# Altium schematic sheet Analogue.SchDoc
size Letter
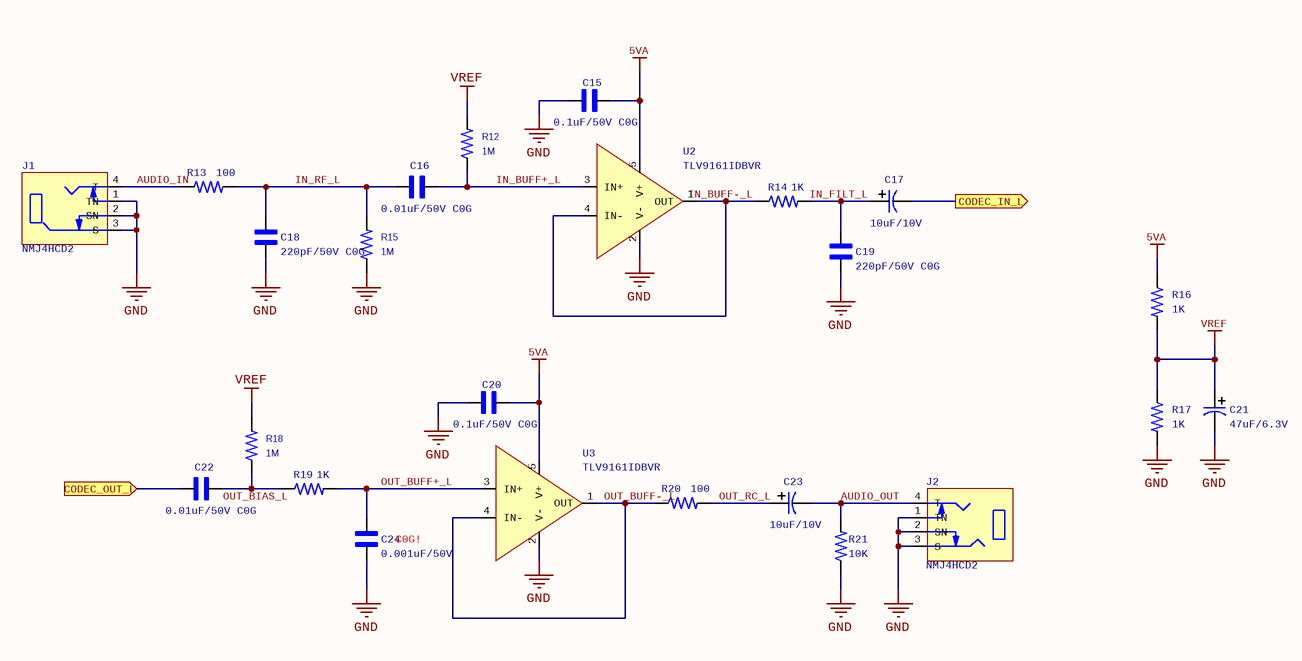
[diagram p0: Analogue.SchDoc]

## Parts
C15  0.1uF/50V C0G  [C0603]
C16  0.01uF/50V C0G  [C0603]
C17  10uF/10V  [EIA1206]
C18  220pF/50V C0G  [C0603]
C19  220pF/50V C0G  [C0603]
C20  0.1uF/50V C0G  [C0603]
C21  47uF/6.3V  [EIA1206]
C22  0.01uF/50V C0G  [C0603]
C23  10uF/10V  [EIA1206]
C24  0.001uF/50V  [C0603]
J1  NMJ4HCD2  [NMJ4HCD2]
J2  NMJ4HCD2  [NMJ4HCD2]
R12  1M  [R0603]
R13  100  [R0603]
R14  1K  [R0603]
R15  1M  [R0603]
R16  1K  [R0603]
R17  1K  [R0603]
R18  1M  [R0603]
R19  1K  [R0603]
R20  100  [R0603]
R21  10K  [R0603]
U2  TLV9161IDBVR  [SOT23-5]
U3  TLV9161IDBVR  [SOT23-5]

## Ports
CODEC_IN_L (out), CODEC_OUT_L (in)

## Nets
5VA: C15.1 C20.1 R16.1 U2.5(V+) U3.5(V+)
GND: C15.2 C18.2 C19.2 C20.2 C21.2 C24.1 J1.1(TN) J1.2(SN) J1.3(S) J2.1(TN) J2.2(SN) J2.3(S) R15.1 R17.2 R21.1 U2.2(V-) U3.2(V-)
VREF: C21.1 R12.2 R16.2 R17.1 R18.2
AUDIO_IN: J1.4(T) R13.1
AUDIO_OUT: C23.2 J2.4(T) R21.2
CODEC_IN_L: C17.2 ; port CODEC_IN_L
CODEC_OUT_L: C22.1 ; port CODEC_OUT_L
IN_BUFF+_L: C16.2 R12.1 U2.3(IN+)
IN_BUFF-_L: R14.1 U2.1(OUT) U2.4(IN-)
IN_FILT_L: C17.1 C19.1 R14.2
IN_RF_L: C16.1 C18.1 R13.2 R15.2
OUT_BIAS_L: C22.2 R18.1 R19.1
OUT_BUFF+_L: C24.2 R19.2 U3.3(IN+)
OUT_BUFF-_L: R20.1 U3.1(OUT) U3.4(IN-)
OUT_RC_L: C23.1 R20.2

## Notes on the sheet
- (near C24) C0G!

## Library data of the parts
C15 C20 = C0603 0.1uF/50V: MLCC 0.1uF 50V C0G 10% 0603; Manufacturer: TDK; Manufacturer Part Number: C1608X5R1H104K080AA; Dielectric Material: Ceramic; Capacitance: 100nF; Dielectric: X5R; Supplier 1: Mouser; Supplier Part Number 1: 810-C1608X5R1H104K; RoHS: Yes; Category: Ceramic Capacitors; Stock 1: 520600; Pricing 1: 1=0.12000, 10=0.04500, 100=0.03700, 500=0.02600, 1000=0.02100, 4000=0.01800 (USD); Mount: Surface Mount; Case/Package: 0603; Number of Pins: 2; Case Code (Metric): 1608; Case Code (Imperial): 0603; Weight: 7.1E-05oz; Min Operating Temperature: -55°C; Max Operating Temperature: 85°C; Tolerance: 10%; Voltage Rating: 50V; Packaging: Tape and Reel; Voltage Rating (DC): 50V; Termination: SMD/SMT; Package Quantity: 1; Resistor Type: Ceramic; Length: 1.6mm; Width: 0.031inch; Height: 0.8mm; Depth: 0.8mm; Thickness: 0.035inch; Radiation Hardening: No; REACH SVHC: No SVHC; Lead Free: Lead Free; Supplier 2: Mouser; Supplier Part Number 2: 187-CL10B104KB8NNNC
C16 C22 = C0603 0.01uF/50V C0G: MLCC 0.01uF 50V C0G 5% 0603; Manufacturer: Murata; Manufacturer Part Number: GRM1885C1H103JA01J; Capacitance: 10nF; Material: 4241ConductorMaterial; Temperature Coefficient: 30ppm/°C; Supplier 1: Mouser; Supplier Part Number 1: 81-GRM1885C1H103JA1J; RoHS: Yes; Category: Ceramic Capacitors; Stock 1: 193832; Pricing 1: 1=0.13, 10=0.052, 50=0.052, 100=0.03, 1000=0.025, 10000=0.018 (USD); Mount: Surface Mount; Case/Package: 0603; Case Code (Metric): 1608; Case Code (Imperial): 0603; Min Operating Temperature: -55°C; Max Operating Temperature: 125°C; Package Quantity: 10000; Packaging: Tape and Reel; Tolerance: 5%; Voltage Rating: 50V; Dielectric: C0G; Termination: SMD/SMT; Voltage Rating (DC): 50V; Series: GRM; Length: 1.6mm; Width: 0.8mm; Height: 0.8mm; RoHS Compliant: Yes; Weight: 0.000222oz
C17 C23 = TANT 10UF/10V: Tantalum Capacitors - Solid SMD 10V 10uF 10%; Manufacturer: KEMET; Manufacturer Part Number: T491A106K010AT; ESR (Equivalent Series Resistance): 4R; Life (Hours): 2000Hour; Polarity: Polar; Dissipation Factor: 6%; Leakage Current: 1uA; Ripple Current: 137mA; Supplier 1: Mouser; RoHS: Yes; Category: Tantalum Capacitors; Stock 1: 88800; Supplier Part Number 1: 80-T491A106K010; Mount: Surface Mount,PCB; Case/Package: 1206; Case Code (Metric): 3216; Case Code (Imperial): 1206; Dielectric Material: Tantalum; Min Operating Temperature: -55°C; Max Operating Temperature: 125°C; Capacitance: 10uF; Tolerance: 10%; Packaging: Tape and Reel; Voltage Rating: 10V; Features: General Purpose; Package Quantity: 2000; Termination: SMD/SMT; Voltage Rating (DC): 10V; Voltage: 10V; Length: 3.2mm; Width: 0.063inch; Height: 1.6mm; Depth: 1.6mm; Height - Seated (Max): 0.071inch; Lead Free: Lead Free; REACH SVHC: No SVHC; Supplier 2: LCSC; Supplier Part Number 2: C110052
C18 C19 = C0603 220pF/50V C0G: MLCC 220pF 50V C0G 5% 0603; Manufacturer: KEMET; Manufacturer Part Number: C0603C221J5GACTU; Dielectric Material: Ceramic; Material: 4241ConductorMaterial; Dissipation Factor: 0.1%; Temperature Coefficient: 30ppm/°C; Supplier 1: Mouser; Supplier Part Number 1: 80-C0603C221J5G; RoHS: Yes; Category: Ceramic Capacitors; Stock 1: 174318; Pricing 1: 1=0.1, 10=0.027, 50=0.027, 100=0.016, 1000=0.011, 10000=0.007 (USD); Mount: Surface Mount; Case/Package: 0603; Min Operating Temperature: -55°C; Max Operating Temperature: 125°C; Packaging: Tape and Reel; Tolerance: 5%; Capacitance: 220pF; Dielectric: C0G; Termination: SMD/SMT; Voltage Rating (DC): 50V; Voltage: 50V; Length: 1.6mm; Height: 0.8mm; Depth: 0.8mm; Radiation Hardening: No; Number of Pins: 2; Case Code (Imperial): 0603; Case Code (Metric): 1608; Package Quantity: 1; Voltage Rating: 50V; Series: C; Construction: Flat; Voltage Rating (AC): 50V; Width: 0.8mm; Thickness: 0.034inch; Lead Pitch: 0.7mm; Lead Free: Lead Free; Reach SVHC Compliant: No; RoHS Compliant: Yes
C21 = TANT 47UF/6.3V: Tantalum Capacitors - Solid SMD 6.3V 47uF 10%; Manufacturer: Kyocera AVX; Manufacturer Part Number: TAJA476K006SNJV; Supplier 1: Mouser; Supplier Part Number 1: 581-TAJA476K006SNJV; RoHS: Yes; Category: Tantalum Capacitors; Stock 1: 97469; Pricing 1: 1=0,57000, 10=0,39900, 50=0,39900, 100=0,20200, 1000=0,15200, 10000=0,12500 (USD); Case/Package: Radial; Voltage Rating (DC): 6.3V; Capacitance: 47uF; Tolerance: 10%; Lead Free: Lead Free; RoHS Compliant: Yes
C24 = C0603 0.001uF/50V: MLCC 0.001uF 50V X5R 10% 0603; Manufacturer: Samsung; Manufacturer Part Number: CL10B102KB8NNNL; Capacitance: 1nF; Dielectric: X7R; Supplier 1: Mouser; Supplier Part Number 1: 187-CL10B102KB8NNNL; RoHS: Yes; Category: Ceramic Capacitors; Stock 1: 55616; Pricing 1: 1=0.10000, 10=0.03500, 50=0.03500, 100=0.01600, 1000=0.00900, 10000=0.00600 (USD); Mount: Surface Mount; Case/Package: 0603; Min Operating Temperature: -55°C; Max Operating Temperature: 125°C; Package Quantity: 15000; Packaging: Tape and Reel; Tolerance: 10%; Voltage Rating: 50V; Voltage Rating (DC): 50V; Series: CL; Construction: Flat; Length: 1.6mm; Width: 0.031inch; Height: 0.8mm; Thickness: 0.035inch; Depth: 0.8mm; Radiation Hardening: No; Lead Free: Lead Free; RoHS Compliant: Yes
J1 J2 = TS Audio Jack 6.3mm: Phone Connectors 2C MONO 2-SPST NC; Manufacturer: Neutrik; Number of Terminals/Pins: 4; Max Current Rating: 3A; Gender: Female; Voltage Rating: 50V; Number of Ports: 1; Number of Contacts: 2; Supplier 1: Mouser; Supplier Part Number 1: 550-12202; Manufacturer Part Number: NMJ4HCD2; RoHS: Yes; Category: Audio / Video Connectors; Stock 1: 39770; Pricing 1: 1=1,51000, 10=1,39000, 50=1,36000, 100=1,18000, 1000=1,11000, 10000=1,10000 (USD); Mount: Through Hole; Number of Pins: 4; Contact Plating: Silver; Color: Black; Contact Material: Brass; Weight: 0.246918oz; Housing Material: Polyamide; Min Operating Temperature: -25°C; Max Operating Temperature: 70°C; Package Quantity: 200; Termination: Through Hole; Orientation: Horizontal; Series: M; RoHS Compliant: Yes; ComponentLink1URL: https://datasheet.ciiva.com/16148/210-199761-16148179.pdf?src-supplier=Onlinecomponents.com; ComponentLink1Description: https://datasheet.ciiva.com/16148/210-199761-16148179.pdf?src-supplier=Onlinecomponents.com
R12 R15 R18 = R0603 1M: RES SMD 1M OHM 1% 1/10W 0603; Manufacturer: Yageo; Manufacturer Part Number: RC0603FR-071ML; Voltage Rating: 75V; Voltage Rating (DC): 50V; Resistance: 1MR; Power Rating: 100mW; Temperature Coefficient: 100ppm/°C; Application(s): HIGH RELIABILITY; Supplier 1: Mouser; Supplier Part Number 1: 603-RC0603FR-071ML; RoHS: Yes; Category: Chip SMD Resistors; Stock 1: 1321822; Pricing 1: 1=0.10000, 10=0.01800, 50=0.01800, 100=0.00700, 1000=0.00400, 10000=0.00200 (USD); Case/Package: 0603; Number of Pins: 2; Case Code (Imperial): 0603; Case Code (Metric): 1608; Weight: 0.000847oz; Min Operating Temperature: -55°C; Max Operating Temperature: 155°C; Tolerance: 1%; Packaging: Cut Tape; Package Quantity: 5000; Termination: SMD/SMT; Resistor Type: Thick Film; Type: General Purpose; Series: RC; Technology: THICK FILM; Length: 1.6mm; Width: 0.8mm; Height: 0.45mm; Depth: 0.8mm; RoHS Compliant: Yes; REACH SVHC: No SVHC; Military Standard: Not; Lead Free: Lead Free
R13 R20 = R0603 100: RES 0603 100 OHM 1% 1/10W; Manufacturer: Yageo; Manufacturer Part Number: RC0603FR-07100RL; Resistance: 100R; Temperature Coefficient: 100ppm/°C; Power Rating: 100mW; Voltage Rating: 50V; Supplier 1: Mouser; Supplier Part Number 1: 603-RC0603FR-07100RL; RoHS: Yes; Category: Chip SMD Resistors; Stock 1: 62434; Pricing 1: 1=0.10000, 10=0.02200, 50=0.02200, 100=0.00800, 1000=0.00600, 10000=0.00400 (USD); Case/Package: 0603; Case Code (Imperial): 0603; Case Code (Metric): 1608; Min Operating Temperature: -55°C; Max Operating Temperature: 155°C; Tolerance: 1%; Resistor Type: Thick Film; Packaging: Tape and Reel; Termination: SMD/SMT; Number of Terminations: 2; Length: 1.6mm; Height: 0.022inch; Width: 0.031inch; Depth: 0.8mm; Lead Free: Lead Free; Military Standard: Not; Contact Plating: Tin,Matte; Weight: 7.1E-05oz; Size Code: 0603; Max Power Dissipation: 100mW; Features: Moisture Resistant,Automotive AEC-Q200; Series: AC; Construction: Rectangular; Radiation Hardening: No; RoHS Compliant: Yes
R14 R16 R17 R19 = R0603 1K: Res Thick Film 0603 1K Ohm 1% 1/10W ±50ppm/°C Molded SMD Paper T/R; Manufacturer: Yageo; Manufacturer Part Number: RE0603FRE071KL; Resistance: 1kR; Max Power Dissipation: 100mW; Supplier 1: Mouser; Supplier Part Number 1: 603-RE0603FRE071KL; RoHS: Yes; Category: Chip SMD Resistors; Stock 1: 21464; Pricing 1: 1=0.11000, 10=0.03800, 50=0.03800, 100=0.01700, 1000=0.00800, 10000=0.00500 (USD); Case/Package: 0603; Min Operating Temperature: -55°C; Max Operating Temperature: 155°C; Packaging: Tape and Reel; Resistor Type: Thick Film; Number of Terminations: 2; Tolerance: 1%; Temperature Coefficient: 50ppm/°C; Features: Moisture Resistant; Length: 0.063inch; Width: 0.032inch; Height: 0.022inch; RoHS Compliant: Yes; ComponentLink1URL: http://www.yageo.com/NewPortal/yageodocoutput?fileName=/pdf/R-Chip/PYu-RE_105_RoHS_L_4.pdf&src-supplier=Digi-Key; ComponentLink1Description: http://www.yageo.com/NewPortal/yageodocoutput?fileName=/pdf/R-Chip/PYu-RE_105_RoHS_L_4.pdf&src-supplier=Digi-Key
R21 = R0603 10K: RES 0603 10K OHM 1% 1/10W; Manufacturer: Yageo; Manufacturer Part Number: RC0603FR-0710KP; Resistance: 10kR; Max Power Dissipation: 100mW; Temperature Coefficient: 150ppm/°C; Supplier 1: Mouser; Supplier Part Number 1: 603-RC0603FR-0710KP; RoHS: Yes; Category: Chip SMD Resistors; Stock 1: 6316; Pricing 1: 1=0.18000, 10=0.04200, 50=0.04200, 100=0.01400, 1000=0.01000, 10000=0.00600 (USD); Case/Package: 0603; Case Code (Metric): 1608; Case Code (Imperial): 0603; Min Operating Temperature: -55°C; Max Operating Temperature: 155°C; Packaging: Tape and Reel; Tolerance: 1%; Resistor Type: Thick Film; Number of Terminations: 2; Features: Moisture Resistant; Length: 0.063inch; Width: 0.031inch; Height: 0.022inch; RoHS Compliant: Yes
U2 U3 = TLV9161IDBVR: Single 10-MHz, 16-V rail-to-rail input/output, very low noise, high slew rate op amp 5-SOT-23 -40 to 125; Manufacturer: Texas Instruments; Supplier 1: Mouser; Manufacturer Part Number: TLV9161IDBVR; RoHS: No; Category: Amplifiers - Op Amps, Buffer, Instrumentation; Stock 1: 20844; Pricing 1: 1=0.94, 10=0.839, 50=0.839, 100=0.654, 1000=0.435, 10000=0.375 (USD); Supplier Part Number 1: 595-TLV9161IDBVR